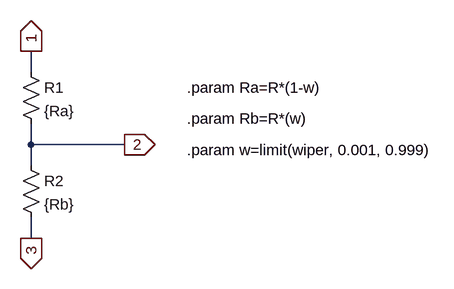
[diagram p0: schematic Potentiometer.asc]
Potentiometer.asc, the LTspice schematic file:
Version 4
SHEET 1 880 680
WIRE 208 80 208 48
WIRE 208 192 208 160
WIRE 352 192 208 192
WIRE 208 224 208 192
WIRE 208 336 208 304
FLAG 208 48 1
IOPIN 208 48 Out
FLAG 208 336 3
IOPIN 208 336 Out
FLAG 352 192 2
IOPIN 352 192 Out
SYMBOL res 192 64 R0
SYMATTR InstName R1
SYMATTR Value {Ra}
SYMBOL res 192 208 R0
SYMATTR InstName R2
SYMATTR Value {Rb}
TEXT 448 104 Left 2 !.param Ra=R*(1-w)
TEXT 448 152 Left 2 !.param Rb=R*(w)
TEXT 448 200 Left 2 !.param w=limit(wiper, 0.001, 0.999)

The netlist it stands for:
* Potentiometer.asc
R1 1 2 {Ra}
R2 2 3 {Rb}
.param Ra=R*(1-w)
.param Rb=R*(w)
.param w=limit(wiper, 0.001, 0.999)
.backanno
.end